# EAGLE design tinyduino-breakout-mk-4.3 (EAGLE 7.5.0)
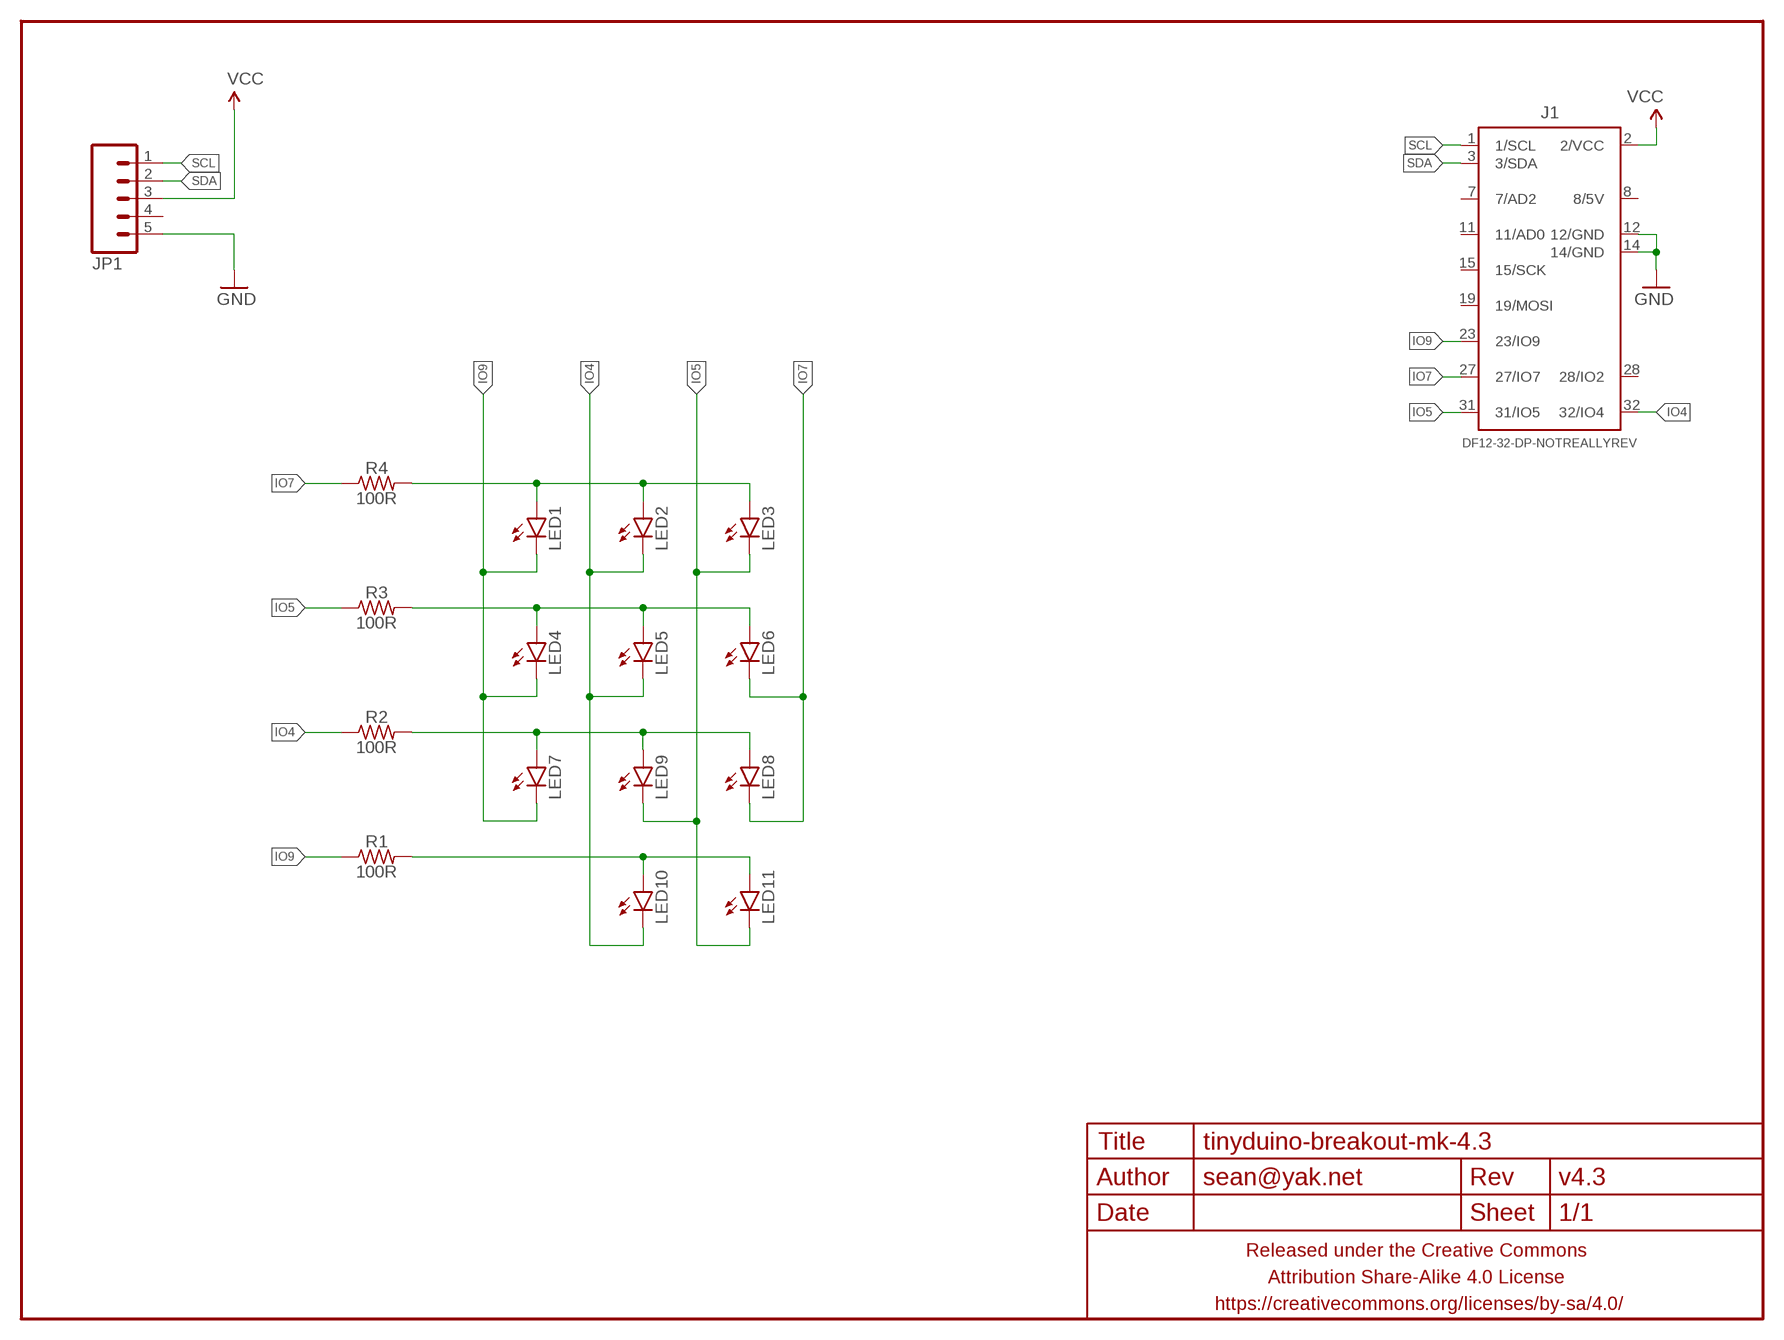
[diagram p0: schematic, sheet 1]

## Parts
FRAME1  FRAME-LETTERNO_PACKAGE  [DUMMY]
J1  DF12-32-DP-NOTREALLYREV  [DF12-32-DP-I2C+EXTRA-REV]
JP1  M05SMD-SHORT  [1X05-SMD-SHORT]
LED1  LED0603  [LED-0603]
LED2  LED0603  [LED-0603]
LED3  LED0603  [LED-0603]
LED4  LED0603  [LED-0603]
LED5  LED0603  [LED-0603]
LED6  LED0603  [LED-0603]
LED7  LED0603  [LED-0603]
LED8  LED0603  [LED-0603]
LED9  LED0603  [LED-0603]
LED10  LED0603  [LED-0603]
LED11  LED0603  [LED-0603]
R1  100R  RESISTORR0603  [R0603]
R2  100R  RESISTORR0603  [R0603]
R3  100R  RESISTORR0603  [R0603]
R4  100R  RESISTORR0603  [R0603]

## Nets
GND: J1.12(12/GND) J1.14(14/GND) JP1.5
IO4: J1.32(32/IO4) LED2.C LED5.C LED10.C R2.1
IO5: J1.31(31/IO5) LED3.C LED9.C LED11.C R3.1
IO7: J1.27(27/IO7) LED6.C LED8.C R4.1
IO9: J1.23(23/IO9) LED1.C LED4.C LED7.C R1.1
N$1: LED1.A LED2.A LED3.A R4.2
N$2: LED4.A LED5.A LED6.A R3.2
N$3: LED7.A LED8.A LED9.A R2.2
N$4: LED10.A LED11.A R1.2
SCL: J1.1(1/SCL) JP1.1
SDA: J1.3(3/SDA) JP1.2
VCC: J1.2(2/VCC) JP1.3
Unconnected: J1.7(7/AD2) J1.8(8/5V) J1.11(11/AD0) J1.15(15/SCK) J1.19(19/MOSI) J1.28(28/IO2) JP1.4

## Library data of the parts
FRAME1 = A_butts:FRAME-LETTER: Schematic Frame Standard 8.5x11 US Letter frame; DESIGNER: sean@yak.net; VERSION: v4.3
J1 = a_parts:DF12-32-DP-NOTREALLY
JP1 = a_parts:M05: Header 5 Standard 5-pin 0.1" header. Use with straight break away headers (SKU : PRT-00116), right angle break away headers (PRT-00553), swiss pins (PRT-00743), machine pins (PRT-00117), and female headers (PRT-00115). Molex polarized connector foot print use with SKU : PRT-08230 with associated crimp pins and housings.
LED1-LED11 = a_parts:LED: LEDs Standard schematic elements and footprints for 5mm, 3mm, 1206, and 0603 sized LEDs. 5mm - Spark Fun Electronics SKU : COM-00529 (and others)
R1-R4 = a_parts:RESISTOR: RESISTOR, American symbol

## Board
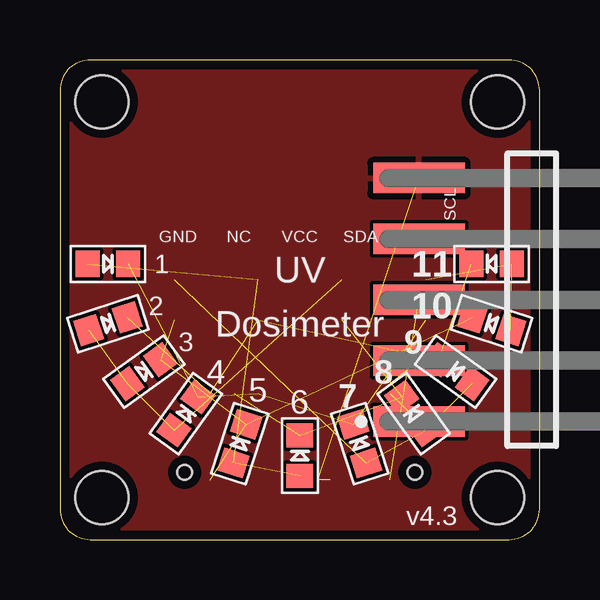
[diagram p1: board, top side]
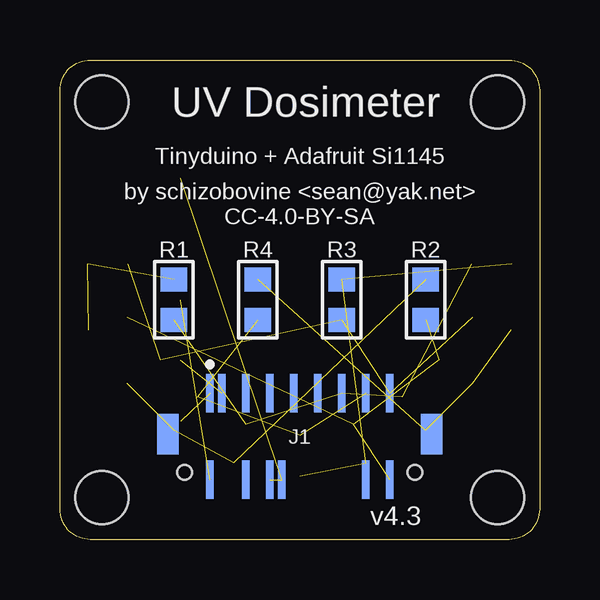
[diagram p2: board, bottom side, seen from below]

Size 20 x 20 mm. Coordinates in mm from the lower left corner, seen from the top.
Outline: 0,18.73 0,1.27 arc90 1.27,0 18.73,0 arc90 20,1.27 20,18.73 arc90 18.73,20 1.27,20 arc90 0,18.73
Copper layers (1*16): Top 0.0356mm / dielectric 1.5011mm / Bottom 0.0356mm
Design rules "LaenPCBOrder_2": minimum track width 6mil, minimum drill 13mil, track to track 6mil, track to pad 6mil, pad to pad 6mil, via to via 6mil, smd to smd 6mil, copper to edge 15mil, drill to drill 6mil, minimum pad ring 7mil, minimum via ring 7mil, stop-mask expansion 3mil, vias tented up to drill 20mil, thermal gap 10mil
Holes 2.2 mm at 1.75,1.75 18.25,1.75 1.75,18.25 18.25,18.25

### Footprints (pad centres in the part's own frame; a part is rotated, then mirrored left to right if it is on the bottom)
DF12-32-DP-I2C+EXTRA-REV = smd 0.3 x 1.6 bottom: 1 -3.75,-1.8; 2 -3.75,1.8; 3 -3.25,-1.8; 7 -2.25,-1.8; 8 -2.25,1.8; 11 -1.25,-1.8; 12 -1.25,1.8; 14 -0.75,1.8; 15 -0.25,-1.8; 19 0.75,-1.8; 23 1.75,-1.8; 27 2.75,-1.8; 28 2.75,1.8; 31 3.75,-1.8; 32 3.75,1.8 | smd 0.9 x 1.7 bottom: F1 -5.5,-0.1; F2 5.5,-0.1 | hole 0.6: -4.8,1.5; 4.8,1.5
1X05-SMD-SHORT = smd 1.27 x 3.81: 1 -5.08,3.175; 2 -2.54,3.175; 3 0,3.175; 4 2.54,3.175; 5 5.08,3.175
LED-0603 = smd 1.1 x 1: A 0,-0.85; C 0,0.85
R0603 = smd 1 x 1.1: 1 -0.85,0; 2 0.85,0

### Placement (x,y rotation side)
FRAME1  0,0 0 top
J1  10,4.3 180 top
JP1  18.15,10 90 top
LED1  5.25,5.25 324 top
LED2  3.5,7 306 top
LED3  2,9 288 top
LED4  2,11.5 270 top
LED5  7.5,4 342 top
LED6  10,3.5 0 top
LED7  12.5,4 18 top
LED8  14.75,5.25 36 top
LED9  16.5,7 54 top
LED10  18,9 72 top
LED11  18,11.5 90 top
R1  15.25,10 90 bottom
R2  4.75,10 90 bottom
R3  8.25,10 90 bottom
R4  11.75,10 90 bottom

### Tracks (layer width: path | path; a pad name or v marks a point on that pad's centre or on a via)
GND  (2 unrouted)
  pour Top: 0,0 0,20 20,20 20,0
IO4  (4 unrouted)
IO5  (4 unrouted)
IO7  (3 unrouted)
IO9  (4 unrouted)
N$1  (3 unrouted)
N$2  (3 unrouted)
N$3  (3 unrouted)
N$4  (2 unrouted)
SCL  (1 unrouted)
SDA  (1 unrouted)
VCC  (1 unrouted)

### Text on the board
tPlace: SCL | GND | NC | VCC | SDA | 1 | 11 | UV | 2 | 10 | Dosimeter | 3 | 9 | 4 | 8 | 5 | 6 | 7
bPlace: UV Dosimeter | Tinyduino + Adafruit Si1145 | by schizobovine <sean@yak.net> / CC-4.0-BY-SA